# Altium schematic sheet SteeringWheel.SchDoc
size 297 x 210 mm
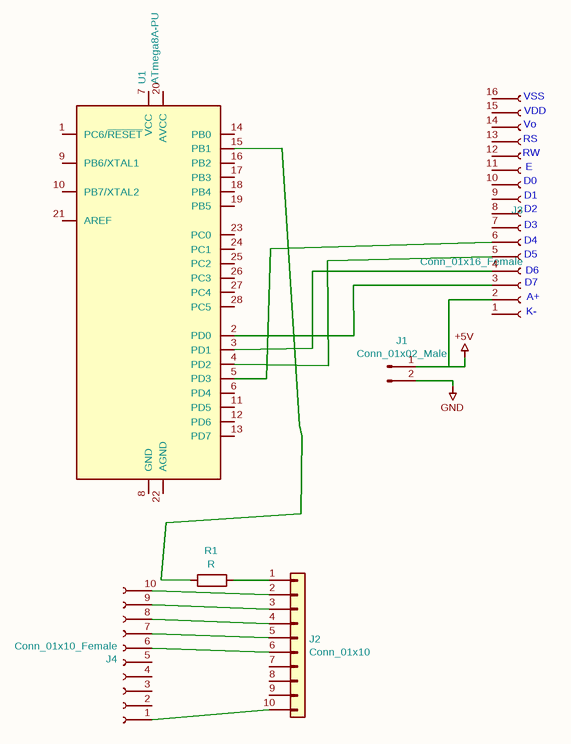
[diagram p0: SteeringWheel.SchDoc]

## Parts
J1  Conn_01x02_Male  [TerminalBlock_Phoenix_MKDS-1,5-2-5.08_1x02_P5.08mm_Horizontal]
J2  Conn_01x10  [TerminalBlock_Phoenix_MPT-0,5-10-2.54_1x10_P2.54mm_Horizontal]
J3  Conn_01x16_Female  [PinSocket_1x16_P2.54mm_Vertical]
J4  Conn_01x10_Female  [TerminalBlock_Phoenix_MPT-0,5-10-2.54_1x10_P2.54mm_Horizontal]
R1  R  [R_Axial_DIN0204_L3.6mm_D1.6mm_P7.62mm_Horizontal]
U1  ATmega8A-PU  [DIP-28_W7.62mm]

## Nets
+5V: J1.1(Pin_1) J3.2(Pin_2)
GND: J1.2(Pin_2)
NetJ2_1: J2.1(Pin_1) R1.1
NetJ2_2: J2.2(Pin_2) J4.10(Pin_10)
NetJ2_3: J2.3(Pin_3) J4.9(Pin_9)
NetJ2_4: J2.4(Pin_4) J4.8(Pin_8)
NetJ2_6: J2.6(Pin_6) J4.6(Pin_6)
NetJ2_10: J2.10(Pin_10) J4.1(Pin_1)
NetJ3_3: J3.3(Pin_3) U1.2(PD0)
NetJ3_4: J3.4(Pin_4) U1.3(PD1)
NetJ3_5: J3.5(Pin_5) U1.4(PD2)
NetJ3_6: J3.6(Pin_6) U1.5(PD3)
NetR1_2: R1.2 U1.15(PB1)

Not connected (* = marked no-connect by the designer): J2 5(Pin_5) 7(Pin_7) 8(Pin_8) 9(Pin_9); J3 1(Pin_1) 7(Pin_7) 8(Pin_8) 9(Pin_9) 10(Pin_10) 11(Pin_11) 12(Pin_12) 13(Pin_13) 14(Pin_14) 15(Pin_15) 16(Pin_16); J4 2(Pin_2) 3(Pin_3) 4(Pin_4) 5(Pin_5) 7(Pin_7); U1 1(PC6/~{RESET}) 6(PD4) 7(VCC) 8(GND) 9(PB6/XTAL1) 10(PB7/XTAL2) 11(PD5) 12(PD6) 13(PD7) 14(PB0) 16(PB2) 17(PB3) 18(PB4) 19(PB5) 20(AVCC) 21(AREF) 22(AGND) 23(PC0) 24(PC1) 25(PC2) 26(PC3) 27(PC4) 28(PC5)

## Notes on the sheet
- (near J3) Vo
- (near J3) VSS
- (near J3) VDD
- (near J3) RW
- (near J3) RS
- (near J3) D0
- (near J3) D1
- (near J3) E
- (near J3) D5
- (near J3) D4
- (near J3) D3
- (near J3) D2
- (near J3) D6
- (near J3) D7
- (near J3) K-
- (near J3) A+
- 1
- 2
- 3
- 4
- 5
- 6
- A
- B
- C
- D
- Title:
- File: SteeringWheel.sch
- Sheet: /
- KiCad E.D.A.  kicad (5.1.4)-1
- Size: A4
- Date:
- Rev:
- Id: 1/1

## Library data of the parts
J1 = Conn_01x02_Male: Value: Conn_01x02_Male; Footprint: TerminalBlock_Phoenix:TerminalBlock_Phoenix_MKDS-1,5-2-5.08_1x02_P5.08mm_Horizontal
J2 = Conn_01x10: Value: Conn_01x10; Footprint: TerminalBlock_Phoenix:TerminalBlock_Phoenix_MPT-0,5-10-2.54_1x10_P2.54mm_Horizontal
J3 = Conn_01x16_Female: Value: Conn_01x16_Female; Footprint: Connector_PinSocket_2.54mm:PinSocket_1x16_P2.54mm_Vertical
J4 = Conn_01x10_Female: Value: Conn_01x10_Female; Footprint: TerminalBlock_Phoenix:TerminalBlock_Phoenix_MPT-0,5-10-2.54_1x10_P2.54mm_Horizontal
R1 = R: Value: R; Footprint: Resistor_THT:R_Axial_DIN0204_L3.6mm_D1.6mm_P7.62mm_Horizontal
U1 = ATmega8A-PU: Value: ATmega8A-PU; Footprint: Package_DIP:DIP-28_W7.62mm